# Altium project volteaHMI_2_0.PrjPcb
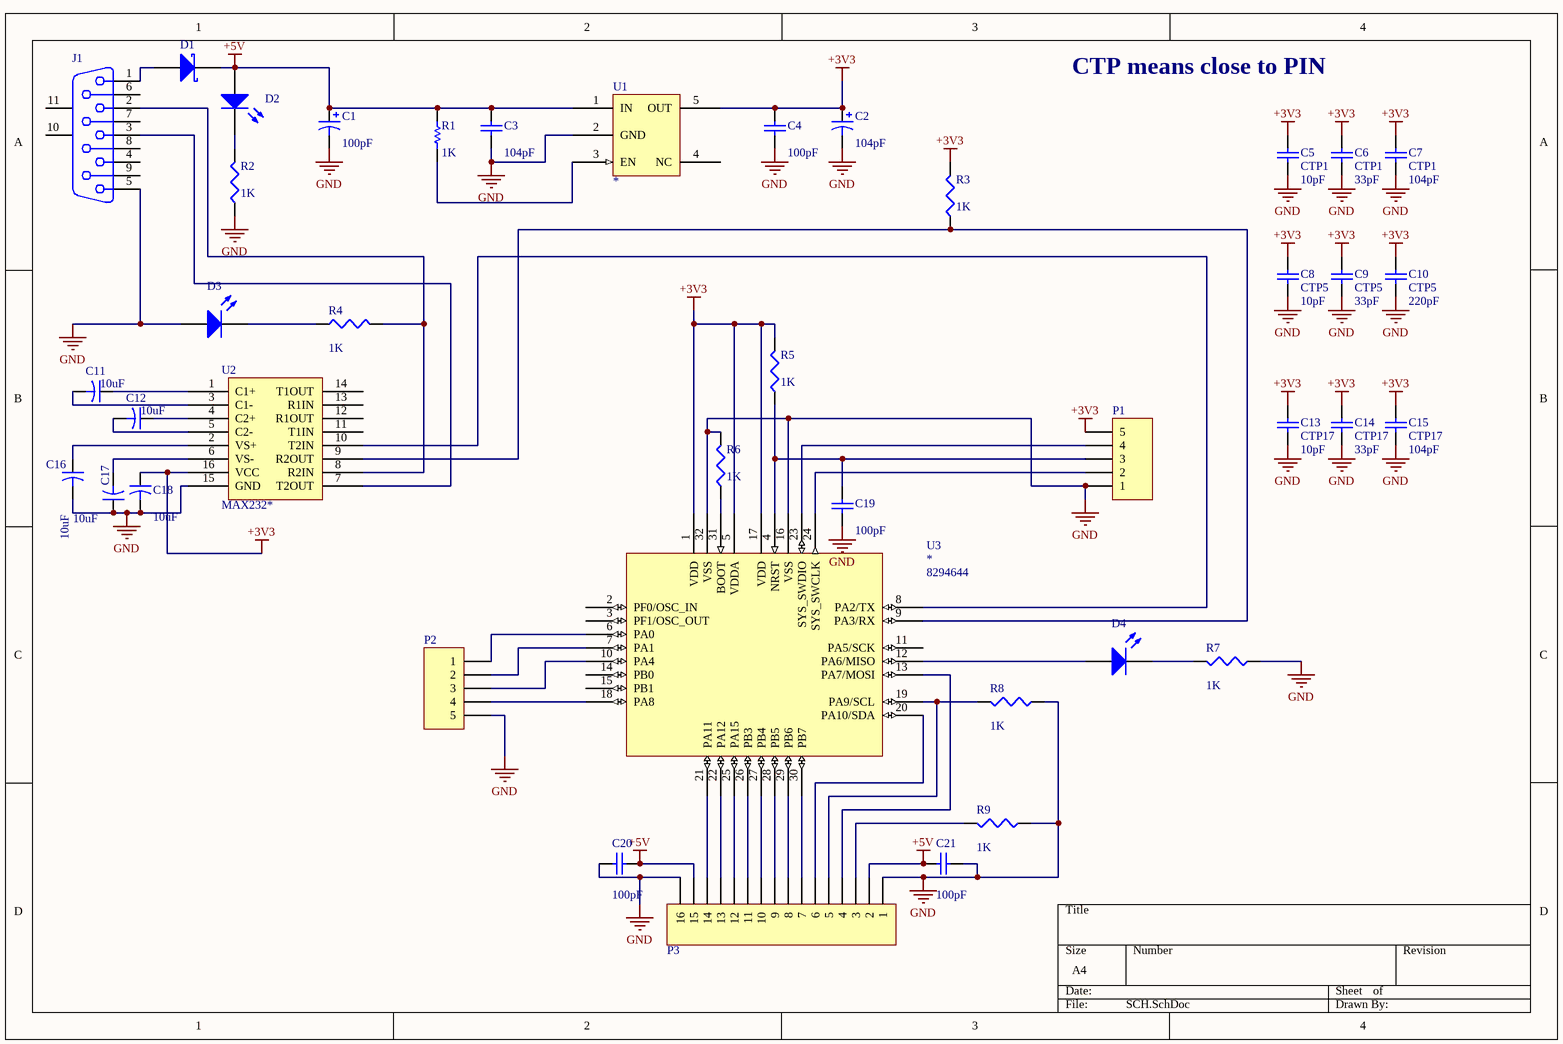
[diagram p0: SCH.SchDoc]
1 sheet, 41 parts. Net scope: global (net labels, ports and power ports of the same name join across sheets).
Board file: HMI_2.0_R0.PcbDoc

## Sheet SCH.SchDoc
size A4

### Parts
C1  value 100pF  [RB7.6-15]
C2  value 104pF  [RB7.6-15]
C3  value 104pF  [0603]
C4  value 100pF  [0603]
C5  CTP1  value 10pF  [0603]
C6  CTP1  value 33pF  [0603]
C7  CTP1  value 104pF  [0603]
C8  CTP5  value 10pF  [0603]
C9  CTP5  value 33pF  [0603]
C10  CTP5  value 220pF  [0603]
C11  value 10uF  [CAPR5-4X5]
C12  value 10uF  [CAPR5-4X5]
C13  CTP17  value 10pF  [0603]
C14  CTP17  value 33pF  [0603]
C15  CTP17  value 104pF  [0603]
C16  value 10uF  [CAPR5-4X5]
C17  value 10uF  [CAPR5-4X5]
C18  value 10uF  [CAPR5-4X5]
C19  value 100pF  [0603]
C20  value 100pF  [0603]
C21  value 100pF  [0603]
D1  (no value)  [SMB]
D2  (no value)  [0805D]
D3  (no value)  [0805D]
D4  (no value)  [0805D]
J1  (no value)  [DSUB1.385-2H9]
P1  (no value)  [HDR1X5]
P2  (no value)  [HDR1X5]
P3  (no value)  [HDR1X16]
R1  value 1K  [0603]
R2  value 1K  [0603]
R3  value 1K  [0603]
R4  value 1K  [0603]
R5  value 1K  [0603]
R6  value 1K  [0603]
R7  value 1K  [0603]
R8  value 1K  [0603]
R9  value 1K  [0603]
U1  *  [SOT-23-5L]
U2  MAX232*  [SSOP16]
U3  *  Supplier Part Number 1: 8294644  [LQFP32]

### Nets
+3V3: C2.1 C4.2 C5.2 C6.2 C7.2 C8.2 C9.2 C10.2 C13.2 C14.2 C15.2 C18.1 P1.5 R3.2 R5.2 U1.5(OUT) U2.16(VCC) U3.1(VDD) U3.5(VDDA) U3.17(VDD)
+5V: C1.1 C3.2 C20.1 C21.2 D1.2(K) D2.1(A) P3.2 P3.15 R1.2 U1.1(IN)
GND: C1.2 C2.2 C3.1 C4.1 C5.1 C6.1 C7.1 C8.1 C9.1 C10.1 C13.1 C14.1 C15.1 C16.2 C17.1 C18.2 C19.1 C20.2 C21.1 D3.1(A) J1.5 P1.1 P2.5 P3.1 P3.16 R2.1 R6.1 R7.2 R8.2 R9.2 U1.2(GND) U2.15(GND) U3.16(VSS) U3.32(VSS)
NetC11_1: C11.1 U2.1(C1+)
NetC11_2: C11.2 U2.3(C1-)
NetC12_1: C12.1 U2.4(C2+)
NetC12_2: C12.2 U2.5(C2-)
NetC16_1: C16.1 U2.2(VS+)
NetC17_2: C17.2 U2.6(VS-)
NetC19_2: C19.2 P1.3 R5.1 U3.4(NRST)
NetD1_1: D1.1(A) J1.1
NetD2_2: D2.2(K) R2.2
NetD3_2: D3.2(K) R4.1
NetD4_1: D4.1(A) U3.12(PA6/MISO)
NetD4_2: D4.2(K) R7.1
NetJ1_2: J1.2 R4.2 U2.8(R2IN)
NetJ1_3: J1.3 U2.7(T2OUT)
NetP1_2: P1.2 U3.24(SYS_SWCLK)
NetP1_4: P1.4 U3.23(SYS_SWDIO)
NetP2_1: P2.1 U3.6(PA0)
NetP2_2: P2.2 U3.7(PA1)
NetP2_3: P2.3 U3.10(PA4)
NetP2_4: P2.4 U3.18(PA8)
NetP3_3: P3.3 R9.1
NetP3_4: P3.4 U3.13(PA7/MOSI)
NetP3_5: P3.5 R8.1 U3.19(PA9/SCL)
NetP3_6: P3.6 U3.20(PA10/SDA)
NetP3_7: P3.7 U3.30(PB7)
NetP3_8: P3.8 U3.29(PB6)
NetP3_9: P3.9 U3.28(PB5)
NetP3_10: P3.10 U3.27(PB4)
NetP3_11: P3.11 U3.26(PB3)
NetP3_12: P3.12 U3.25(PA15)
NetP3_13: P3.13 U3.22(PA12)
NetP3_14: P3.14 U3.21(PA11)
NetR1_1: R1.1 U1.3(EN)
NetR3_1: R3.1 U2.9(R2OUT) U3.9(PA3/RX)
NetR6_2: R6.2 U3.31(BOOT)
NetU2_10: U2.10(T2IN) U3.8(PA2/TX)

Not connected (* = marked no-connect by the designer): J1 4 6 7 8 9 10(MH1) 11(MH2); U1 4(NC); U2 11(T1IN) 12(R1OUT) 13(R1IN) 14(T1OUT); U3 2(PF0/OSC_IN) 3(PF1/OSC_OUT) 11(PA5/SCK) 14(PB0) 15(PB1)

### Notes on the sheet
- CTP means close to PIN

### Library data of the parts
C1 C2 = Cap Pol1: Polarized Capacitor (Radial); Published: 8-Jun-2000; LatestRevisionDate: 17-Jul-2002; LatestRevisionNote: Re-released for DXP Platform.; PackageReference: RB7.6-15; Publisher: Altium Limited; PackageDescription: Polarized Capacitor (Radial); 2 Leads
C3-C10 C13-C15 C19-C21 = Cap: Capacitor; Published: 8-Jun-2000; LatestRevisionDate: 17-Jul-2002; LatestRevisionNote: Re-released for DXP Platform.; PackageReference: RAD-0.3; Publisher: Altium Limited; PackageDescription: Radial Cap, Thru-Hole; 2 Leads; 0.3 in Pin Spacing
C11 C12 C16-C18 = Cap2: Capacitor; Published: 23-Sep-2002; PackageReference: CAPR5-4X5; Publisher: Altium Limited; PackageDescription: Capacitor; 2 Leads
D1 = D Schottky: Schottky Diode; Published: 8-Jun-2000; LatestRevisionDate: 17-Jul-2002; LatestRevisionNote: Re-released for DXP Platform.; PackageReference: SMB; Publisher: Altium Limited; PackageDescription: DO-214-AA/SMB; 2 C-Bend Leads; Body 5.3 x 3.6 mm, inc. leads (LxW); Code_JEDEC: DO-214-AA
D2-D4 = LED0: Typical INFRARED GaAs LED; Published: 8-Jun-2000; LatestRevisionDate: 08-Jul-2005; LatestRevisionNote: Mech Layer 1 removed.; PackageReference: LED-0; Publisher: Altium Limited; PackageDescription: LED; 2 Leads
J1 = D Connector 9: Receptacle Assembly, 9 Position, Right Angle; PackageDocument: O; Positions: 9; Published: 15-Jun-2001; LatestRevisionDate: 17-Jul-2002; LatestRevisionNote: Re-released for DXP Platform.; DatasheetDocument: 1-Sep-1999; PackageReference: 788750; Publisher: Altium Limited; Orientation: Right Angle; Gender: Receptacle
P1 P2 = Header 5: Header, 5-Pin; LatestRevisionDate: 17-Jul-2002; LatestRevisionNote: Re-released for DXP Platform.; Publisher: Altium Limited
P3 = Header 16: Header, 16-Pin; LatestRevisionDate: 17-Jul-2002; LatestRevisionNote: Re-released for DXP Platform.; Publisher: Altium Limited
R1 = Res Semi: Semiconductor Resistor; Published: 8-Jun-2000; LatestRevisionDate: 17-Jul-2002; LatestRevisionNote: Re-released for DXP Platform.; PackageReference: AXIAL-0.5; Publisher: Altium Limited; PackageDescription: Axial Device, Thru-Hole; 2 Leads; 0.5 in Pin Spacing
R2-R9 = Res3: Resistor; Published: 8-Jun-2000; LatestRevisionDate: 29-May-2009; LatestRevisionNote: IPC-7351 Footprint Added.; PackageReference: J1-0603; Publisher: Altium Limited; PackageDescription: Chip Resistor
U1 = VRH3302
U2 = MAX232
U3 = STM32F030K6: Supplier 1: RSComponents